# EasyEDA Pro project SD-Swicharoo.eprj, board SD_Swicharoo
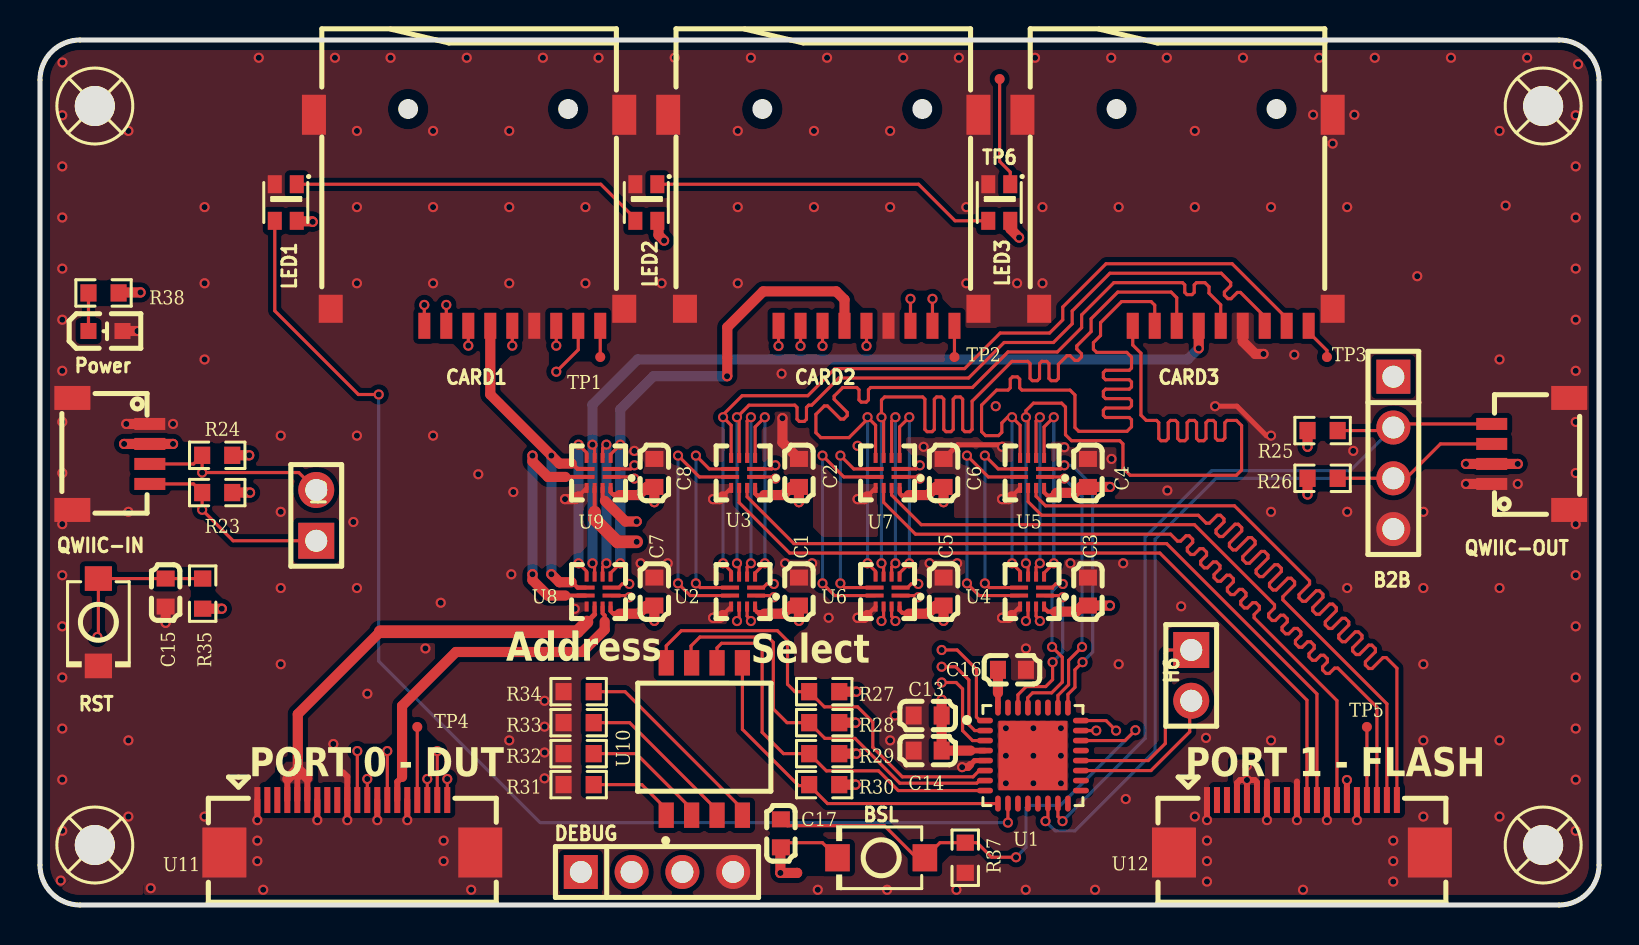
[diagram p2: board, top side]
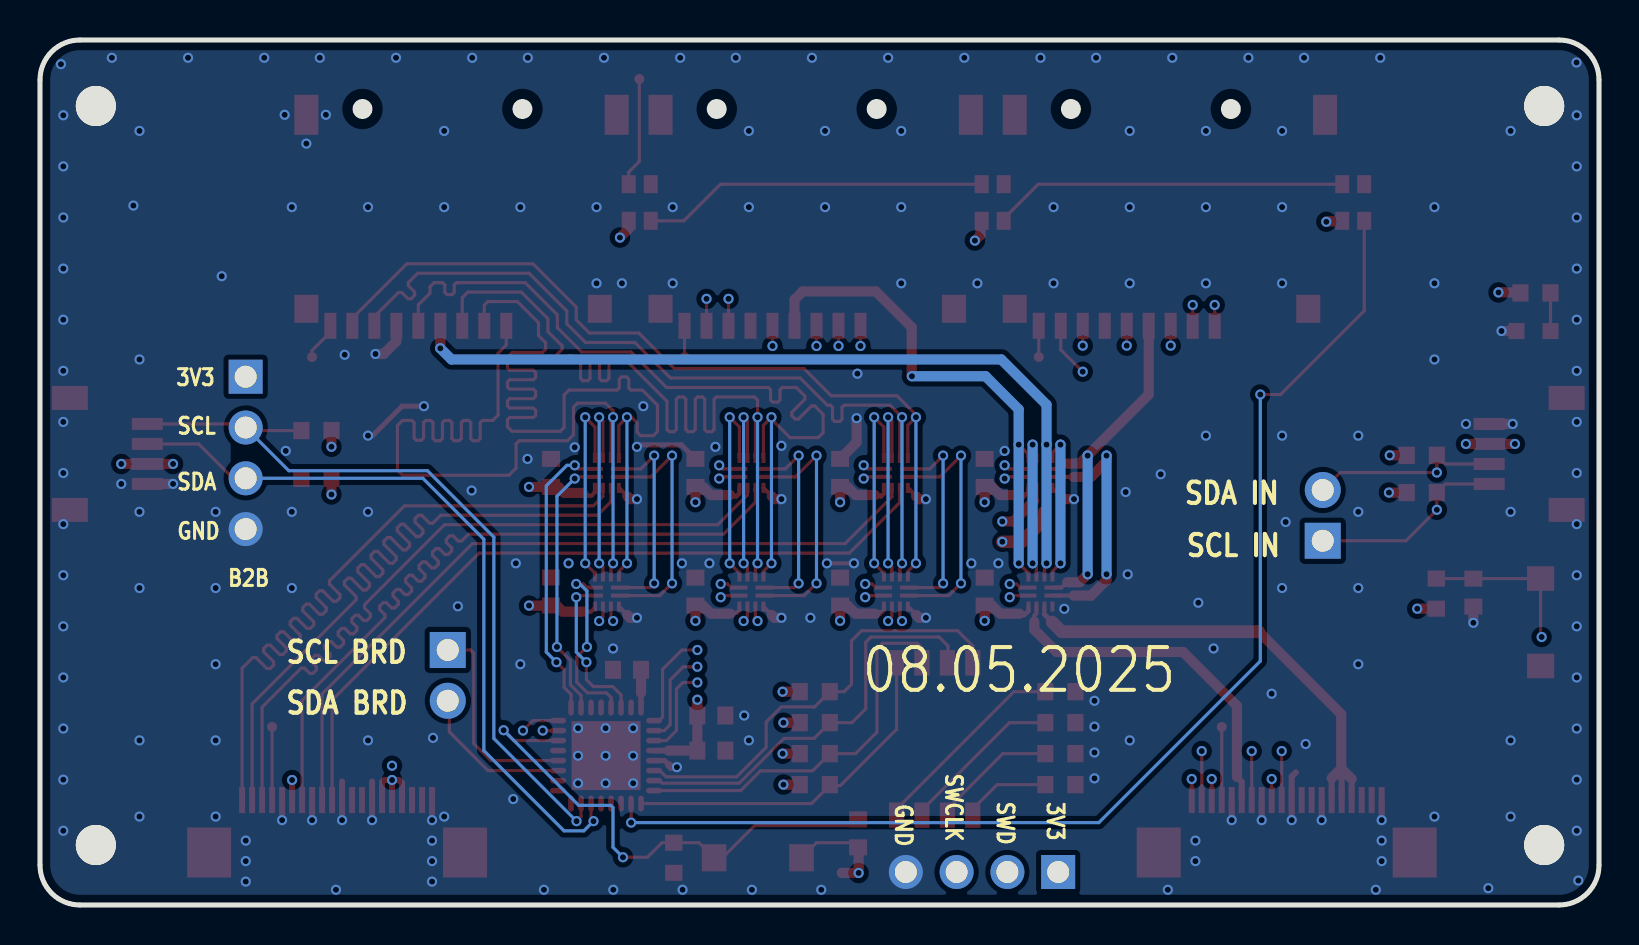
[diagram p3: board, bottom side, seen from below]

Outline 77.98 x 43.26 mm; copper layers: Top Layer, GND02, SIG03, GND04, PWR05, Bottom Layer. Coordinates in mm from the lower left corner of the outline.
Outline path: 0,41.26 0,2 arc(0.59,0.59) 2,0 75.98,0 arc(77.39,0.59) 77.98,2 77.98,41.26 arc(77.39,42.67) 75.98,43.26 2,43.26 arc(0.59,42.67) 0,41.26
Stack: Top Layer 0.035mm 外层铜厚1oz / Dielectric1 0.0994mm 3313 RC57% 4.2mil / GND02 0.0152mm 内层铜厚 / Dielectric2 0.55mm 0.55mm H/H No copper / SIG03 0.0152mm 内层铜厚 / Dielectric3 0.1088mm 2116 RC54% 4.9mil / GND04 0.0152mm 内层铜厚 / Dielectric4 0.55mm 0.55mm H/H No copper / PWR05 0.0152mm 内层铜厚 / Dielectric5 0.0994mm 3313 RC57% 4.2mil / Bottom Layer 0.035mm 外层铜厚1oz

## Design rules (mm)
net GND: PWR
net SD0_DAT2: SD0
net SD0_DAT3: SD0
net SD0_CMD: SD0
net SD0_VDD: PWR
net SD0_CLK: SD0
net SD0_DAT0: SD0
net SD0_DAT1: SD0
net SD0_CD: SD0
net SD1_DAT2: SD1
net SD1_DAT3: SD1
net SD1_CMD: SD1
net SD1_VDD: PWR
net SD1_CLK: SD1
net SD1_DAT0: SD1
net SD1_DAT1: SD1
net SD1_CD: SD1
net SD2_DAT2: SD2
net SD2_DAT3: SD2
net SD2_CMD: SD2
net SD2_VDD: PWR
net SD2_CLK: SD2
net SD2_DAT0: SD2
net SD2_DAT1: SD2
net SD2_CD: SD2
net SDIN_DET: SDIN
net SDIN_DAT2: SDIN
net SDIN_DAT3: SDIN
net SDIN_CMD: SDIN
net SDIN_CLK: SDIN
net SDIN_DAT0: SDIN
net SDIN_DAT1: SDIN
net SDIN_1V8: PWR
net SDOUT_DET: SDOUT
net SDOUT_DAT2: SDOUT
net SDOUT_DAT3: SDOUT
net SDOUT_CMD: SDOUT
net SDOUT_CLK: SDOUT
net SDOUT_DAT0: SDOUT
net SDOUT_DAT1: SDOUT
net SDOUT_1V8: PWR
net SD0_1V8: PWR
net SD2_1V8: PWR
net SD1_1V8: PWR
net 3V3: PWR
template: 自定义配置
spacing copperThickness1oz (default): track to track 0.157, other pairs 0.152 to 0.508
spacing 3W: track to track 0.315, other pairs 0.152 to 0.3
spacing safeClearance1: track to track 0.284, other pairs 0.152 to 0.3
track width copperThickness1oz (default): min 0.127, default 0.157, max 2.54
track width PWR: min 0.127, default 0.508, max 2.54
track width 50OHM L1/L6: min 0.127, default 0.157, max 2.54
track width 50OHM-L3: min 0.127, default 0.142, max 2.54
differential pair differentialPair (default): width min 0.127, default 0.254, max 2.54; gap min 0.152, default 0.152
via viaSize (default): diameter min 0.5, default 0.508, max 10; hole min 0.3, default 0.305, max 6.299
net class PWR uses PWR
net class SD0 uses 50OHM-L3, safeClearance1
net class SD1 uses 50OHM-L3, safeClearance1
net class SD2 uses 3W, 50OHM L1/L6
net class SDIN uses 50OHM-L3, safeClearance1
net class SDOUT uses 3W, 50OHM L1/L6
net GND uses PWR
net SD0_DAT2 uses 50OHM-L3, safeClearance1
net SD0_DAT3 uses 50OHM-L3, safeClearance1
net SD0_CMD uses 50OHM-L3, safeClearance1
net SD0_VDD uses PWR
net SD0_CLK uses 50OHM-L3, safeClearance1
net SD0_DAT0 uses 50OHM-L3, safeClearance1
net SD0_DAT1 uses 50OHM-L3, safeClearance1
net SD0_CD uses 50OHM-L3, safeClearance1
net SD1_DAT2 uses 50OHM-L3, safeClearance1
net SD1_DAT3 uses 50OHM-L3, safeClearance1
net SD1_CMD uses 50OHM-L3, safeClearance1
net SD1_VDD uses PWR
net SD1_CLK uses 50OHM-L3, safeClearance1
net SD1_DAT0 uses 50OHM-L3, safeClearance1
net SD1_DAT1 uses 50OHM-L3, safeClearance1
net SD1_CD uses 50OHM-L3, safeClearance1
net SD2_DAT2 uses 3W, 50OHM L1/L6
net SD2_DAT3 uses 3W, 50OHM L1/L6
net SD2_CMD uses 3W, 50OHM L1/L6
net SD2_VDD uses PWR
net SD2_CLK uses 3W, 50OHM L1/L6
net SD2_DAT0 uses 3W, 50OHM L1/L6
net SD2_DAT1 uses 3W, 50OHM L1/L6
net SD2_CD uses 3W, 50OHM L1/L6
net SDIN_DET uses 50OHM-L3, safeClearance1
net SDIN_DAT2 uses 50OHM-L3, safeClearance1
net SDIN_DAT3 uses 50OHM-L3, safeClearance1
net SDIN_CMD uses 50OHM-L3, safeClearance1
net SDIN_CLK uses 50OHM-L3, safeClearance1
net SDIN_DAT0 uses 50OHM-L3, safeClearance1
net SDIN_DAT1 uses 50OHM-L3, safeClearance1
net SDIN_1V8 uses PWR
net SDOUT_DET uses 3W, 50OHM L1/L6
net SDOUT_DAT2 uses 3W, 50OHM L1/L6
net SDOUT_DAT3 uses 3W, 50OHM L1/L6
net SDOUT_CMD uses 3W, 50OHM L1/L6
net SDOUT_CLK uses 3W, 50OHM L1/L6
net SDOUT_DAT0 uses 3W, 50OHM L1/L6
net SDOUT_DAT1 uses 3W, 50OHM L1/L6
net SDOUT_1V8 uses PWR
net SD0_1V8 uses PWR
net SD2_1V8 uses PWR
net SD1_1V8 uses PWR
net 3V3 uses PWR
region e236 uses copperThickness1oz
region e237 uses copperThickness1oz
region e238 uses copperThickness1oz
region e240 uses copperThickness1oz
region e1231 uses copperThickness1oz
region e1232 uses copperThickness1oz
region e3776 uses copperThickness1oz
region e4768 uses copperThickness1oz
pour e4718 uses PWR
region e386 uses copperThickness1oz

## Placement (name value [footprint] x y rotation side)
B2B  PZ254V-11-04P  [HDR-TH_4P-P2.54-V-M]  67.69 22.61 270 top
BSL  TS-1088-AR02016  [SW-SMD_L3.9-W3.0-P4.45]  42.07 2.36 180 top
C1  0.1uF  [C0603]  37.96 15.67 270 top
C2  0.1uF  [C0603]  37.96 21.61 270 top
C3  0.1uF  [C0603]  52.42 15.67 270 top
C4  0.1uF  [C0603]  52.42 21.61 270 top
C5  0.1uF  [C0603]  45.19 15.67 270 top
C6  0.1uF  [C0603]  45.19 21.61 270 top
C7  0.1uF  [C0603]  30.73 15.67 270 top
C8  0.1uF  [C0603]  30.73 21.61 270 top
C13  10uF  [C0603]  44.4 9.48 180 top
C14  100nF  [C0603]  44.4 7.72 180 top
C15  10nF  [C0603]  6.28 15.63 270 top
C16  0.47uF  [C0603]  48.61 11.76 0 top
C17  10nF  [C0603]  37.06 3.58 270 top
CARD1  TF-01A  [TF-SMD_TF-01A]  21.46 34.24 180 top
CARD2  TF-01A  [TF-SMD_TF-01A]  39.18 34.24 180 top
CARD3  TF-01A  [TF-SMD_TF-01A]  56.9 34.24 180 top
DEBUG  PZ254V-11-04P  [HDR-TH_4P-P2.54-V-M]  30.86 1.65 0 top
H5  -  [HDR-TH_2P-P2.54-V-M-1]  13.82 19.48 90 top
H6  -  [HDR-TH_2P-P2.54-V-M-1]  57.58 11.48 270 top
LED1  WS2812B-2020  [LED-SMD_4P-L2.0-W2.0-TL_WS2812B-2020]  12.29 35.13 270 top
LED2  WS2812B-2020  [LED-SMD_4P-L2.0-W2.0-TL_WS2812B-2020]  30.33 35.13 270 top
LED3  WS2812B-2020  [LED-SMD_4P-L2.0-W2.0-TL_WS2812B-2020]  47.98 35.13 270 top
Power  SZYY0603YG  [LED0603-R-RD_GREEN]  3.28 28.7 0 top
QWIIC-IN  SM04B-SRSS-TB(LF)(SN)  [CONN-SMD_4P-P1.00_SM04B-SRSS-TB-LF-SN]  3.56 22.56 270 top
QWIIC-OUT  SM04B-SRSS-TB(LF)(SN)  [CONN-SMD_4P-P1.00_SM04B-SRSS-TB-LF-SN]  74.55 22.56 90 top
R23  4.7K  [R0603]  8.86 20.63 0 top
R24  4.7K  [R0603]  8.86 22.49 0 top
R25  4.7K  [R0603]  64.15 23.73 180 top
R26  4.7K  [R0603]  64.15 21.34 180 top
R27  1K  [R0603]  39.22 10.67 0 top
R28  1K  [R0603]  39.22 9.12 0 top
R29  1K  [R0603]  39.22 7.57 0 top
R30  1K  [R0603]  39.22 6.02 0 top
R31  100K  [R0603]  26.94 6.02 0 top
R32  1K  [R0603]  26.94 7.57 0 top
R33  1K  [R0603]  26.94 9.12 0 top
R34  1K  [R0603]  26.94 10.67 0 top
R35  47K  [R0603]  8.14 15.57 270 top
R37  47K  [R0603]  46.28 2.36 90 top
R38  1K  [R0603]  3.18 30.61 0 top
RST  TS-1088-AR02016  [SW-SMD_L3.9-W3.0-P4.45]  2.92 14.14 270 top
SCREW1  -  [Screw-Hole-M2]  2.74 39.96 0 top
SCREW2  -  [Screw-Hole-M2]  75.18 39.96 0 top
SCREW3  -  [Screw-Hole-M2]  2.74 3 0 top
SCREW4  -  [Screw-Hole-M2]  75.18 3 0 top
TP1  -  [Test-Point-0.5mm]  28.02 27.41 0 top
TP2  -  [Test-Point-0.5mm]  45.74 27.41 0 top
TP3  -  [Test-Point-0.5mm]  64.37 27.41 0 top
TP4  -  [Test-Point-0.5mm]  18.87 8.9 0 top
TP5  -  [Test-Point-0.5mm]  66.37 8.9 0 top
TP6  -  [Test-Point-0.5mm]  48 41.31 0 top
U1  MSPM0L1227SRHBR  [VQFN-32_L5.0-W5.0-P0.50-TL-EP3.5]  49.66 7.47 0 top
U2  TMUX131RMGR  [QFN-12L_L1.8-W1.8-P0.40-TL_TS3USB3031RMGR]  35.17 15.67 180 top
U3  TMUX131RMGR  [QFN-12L_L1.8-W1.8-P0.40-TL_TS3USB3031RMGR]  35.17 21.61 180 top
U4  TMUX131RMGR  [QFN-12L_L1.8-W1.8-P0.40-TL_TS3USB3031RMGR]  49.62 15.67 180 top
U5  TMUX131RMGR  [QFN-12L_L1.8-W1.8-P0.40-TL_TS3USB3031RMGR]  49.62 21.61 180 top
U6  TMUX131RMGR  [QFN-12L_L1.8-W1.8-P0.40-TL_TS3USB3031RMGR]  42.39 15.67 180 top
U7  TMUX131RMGR  [QFN-12L_L1.8-W1.8-P0.40-TL_TS3USB3031RMGR]  42.4 21.61 180 top
U8  TMUX131RMGR  [QFN-12L_L1.8-W1.8-P0.40-TL_TS3USB3031RMGR]  27.94 15.67 180 top
U9  TMUX131RMGR  [QFN-12L_L1.8-W1.8-P0.40-TL_TS3USB3031RMGR]  27.94 21.61 180 top
U10  HX 1.27-4P TPPT  [SW-SMD_8P-P1.27-L6.7-W5.4]  33.23 8.3 0 top
U11  05A20L20P  [FPC-SMD_20P-P0.50_L5.9-W14.4]  15.62 3.94 0 top
U12  05A20L20P  [FPC-SMD_20P-P0.50_L5.9-W14.4]  63.12 3.94 0 top

## Footprints (pads in the part's own frame, mm; a bottom-side part is the same pattern mirrored in y, then rotated)
C0603
  rect 0.8x0.9 smd: 1(-0.7,0) 2(0.7,0)
CONN-SMD_4P-P1.00_SM04B-SRSS-TB-LF-SN
  rect 0.6x1.55 smd: 1(-1.5,1.938) 2(-0.5,1.938) 3(0.5,1.938) 4(1.5,1.938)
  rect 1.2x1.8 smd: 5(2.8,-1.938) 6(-2.8,-1.938)
FPC-SMD_20P-P0.50_L5.9-W14.4
  rect 0.3x1.3 smd: 1(-4.75,1.312) 2(-4.25,1.312) 3(-3.75,1.312) 4(-3.25,1.312) 5(-2.75,1.312) 6(-2.25,1.312) 7(-1.75,1.312) 8(-1.25,1.312) 9(-0.75,1.312) 10(-0.25,1.312) 11(0.25,1.312) 12(0.75,1.312) 13(1.25,1.312) 14(1.75,1.312) 15(2.25,1.312) 16(2.75,1.312) 17(3.25,1.312) 18(3.75,1.312) 19(4.25,1.312) 20(4.75,1.312)
  rect 2.2x2.5 smd: 21(-6.4,-1.312) 22(6.4,-1.312)
HDR-TH_2P-P2.54-V-M-1
  rect 1.8x1.8 hole 1.1: 1(-1.27,0)
  round 1.8 hole 1.1: 2(1.27,0)
HDR-TH_4P-P2.54-V-M
  rect 1.7x1.7 hole 1.1: 1(-3.81,0)
  round 1.7 hole 1.1: 2(-1.27,0) 3(1.27,0) 4(3.81,0)
LED0603-R-RD_GREEN
  rect 0.8x0.8 smd: 1(0.851,0) 2(-0.851,0)
LED-SMD_4P-L2.0-W2.0-TL_WS2812B-2020
  rect 0.9x0.7 smd: 1(-0.915,0.55) 2(-0.915,-0.55) 3(0.915,-0.55) 4(0.915,0.55)
QFN-12L_L1.8-W1.8-P0.40-TL_TS3USB3031RMGR
  rect 0.9x0.2 smd: 1(-0.65,0.2) 2(-0.65,-0.2) 7(0.65,-0.2) 8(0.65,0.2)
  rect 0.2x0.5 smd: 3(-0.6,-0.75) 4(-0.2,-0.75) 5(0.2,-0.75) 6(0.6,-0.75) 9(0.6,0.75) 10(0.2,0.75) 11(-0.2,0.75) 12(-0.6,0.75)
R0603
  rect 0.806x0.864 smd: 1(-0.753,0) 2(0.753,0)
Screw-Hole-M2
  round 2 hole 2: 1(0,0)
SW-SMD_8P-P1.27-L6.7-W5.4
  rect 0.76x1.27 smd: 1(-1.905,-3.81) 2(-0.635,-3.81) 3(0.635,-3.81) 4(1.905,-3.81) 5(1.905,3.81) 6(0.635,3.81) 7(-0.635,3.81) 8(-1.905,3.81)
SW-SMD_L3.9-W3.0-P4.45
  rect 1.23x1.36 smd: 1(-2.185,0) 2(2.185,0)
Test-Point-0.5mm
  round 0.5 smd: 1(0,0)
TF-SMD_TF-01A
  rect 0.6x1.3 smd: 1(2.24,5.276) 2(1.14,5.276) 3(0.04,5.276) 4(-1.06,5.276) 5(-2.16,5.276) 6(-3.26,5.276) 7(-4.36,5.276) 8(-5.46,5.276) 9(-6.56,5.276)
  rect 1.2x1.4 smd: 10(-7.76,4.426) 13(6.92,4.426)
  rect 1.2x2 smd: 11(-7.76,-5.276) 12(7.76,-5.276)
VQFN-32_L5.0-W5.0-P0.50-TL-EP3.5
  oval 0.8x0.28 smd: 1(-2.4,1.75) 2(-2.4,1.25) 3(-2.4,0.75) 4(-2.4,0.25) 5(-2.4,-0.25) 6(-2.4,-0.75) 7(-2.4,-1.25) 8(-2.4,-1.75) 17(2.4,-1.75) 18(2.4,-1.25) 19(2.4,-0.75) 20(2.4,-0.25) 21(2.4,0.25) 22(2.4,0.75) 23(2.4,1.25) 24(2.4,1.75)
  oval 0.28x0.8 smd: 9(-1.75,-2.4) 10(-1.25,-2.4) 11(-0.75,-2.4) 12(-0.25,-2.4) 13(0.25,-2.4) 14(0.75,-2.4) 15(1.25,-2.4) 16(1.75,-2.4) 25(1.75,2.4) 26(1.25,2.4) 27(0.75,2.4) 28(0.25,2.4) 29(-0.25,2.4) 30(-0.75,2.4) 31(-1.25,2.4) 32(-1.75,2.4)
  rect 3.45x3.45 smd: 33(-0.001,0)

## Nets
As in the schematic, except:
GND: B2B.4 C1.1 C2.1 C3.1 C4.1 C5.1 C6.1 C7.1 C8.1 C13.2 C14.2 C15.2 C16.2 CARD1.6 CARD1.10 CARD1.11 CARD1.12 CARD1.13 CARD2.6 CARD2.10 CARD2.11 CARD2.12 CARD2.13 CARD3.6 CARD3.10 CARD3.11 CARD3.12 CARD3.13 DEBUG.4 LED1.2 LED2.2 LED3.2 Power.1 QWIIC-IN.1 QWIIC-IN.5 QWIIC-IN.6 QWIIC-OUT.1 QWIIC-OUT.5 QWIIC-OUT.6 R31.1 R32.1 R33.1 R34.1 R37.1 RST.2 SCREW1.1 SCREW2.1 SCREW3.1 SCREW4.1 U1.5 U1.33 U2.9 U3.9 U4.9 U5.9 U6.9 U7.9 U8.9 U9.9 U11.1 U11.7 U11.10 U11.13 U11.16 U11.21 U11.22 U12.1 U12.7 U12.10 U12.13 U12.16 U12.21 U12.22
$1N18208: Power.2 R38.1

Pads without a net: U1 11 12 13 16 17 18 21 27 28 31

## Via types
v1: diameter 0.508, hole 0.305, Top Layer to Bottom Layer, 354 vias

## Routing (per net, layer and track width the routed paths; a pad name or vN(x,y) marks a point on that pad's centre or on a via; arc(x,y) is an arc through that point)
3V3: length 55.7
  Top Layer w0.158: BSL.2 39.14,3.12 37.29,3.12 C17.2
  Top Layer w0.201: 36.22,20.5 36.14,20.42 35.92,20.42 35.85,20.49 ; 28.91,14.49 28.74,14.49 28.64,14.6 ; 50.56,20.48 50.39,20.48 50.22,20.64 U5.12 ; 50.56,20.48 50.7,20.48 50.83,20.61 ; 50.56,20.48 50.7,20.61 50.7,20.65 ; 28.64,20.55 28.77,20.42 28.91,20.42 ; 28.64,20.55 28.85,20.55 ; 28.64,20.55 28.54,20.65 28.54,20.86 ; 50.56,14.67 50.81,14.67 ; 50.56,14.67 50.67,14.56 ; 50.56,14.67 50.41,14.67 50.22,14.86 U4.12 ; 28.64,14.6 28.54,14.7 28.54,14.92 ; 28.64,14.6 28.79,14.6 28.8,14.61 ; 35.87,14.65 36.12,14.65 ; 35.87,14.65 35.97,14.56 ; 35.87,14.65 35.77,14.76 U2.12 ; 43.09,20.49 43.13,20.48 43.23,20.48 ; 43.09,20.49 43.15,20.42 43.38,20.42 ; 43.09,20.49 43,20.57 43,20.86 ; 43.21,14.61 43.13,14.61 42.99,14.74 U6.12 ; 43.21,14.61 43.26,14.61 ; 43.21,14.61 43.33,14.48 ; 36,20.48 35.9,20.48 35.85,20.49 ; 35.85,20.49 35.77,20.57 U3.12 ; 35.97,14.56 36.09,14.43 ; 35.97,14.56 36.21,14.56
  Top Layer w0.28: U1.4 46.54,7.72
  Top Layer w0.508: R25.2 v1(63.4,22.92) ; v1(13.64,34.17) 13.61,34.19 12.88,34.19 ; v1(73.91,22.06) QWIIC-OUT.2 v1(71.32,22.06) ; C17.2 37.03,2.86 v1(37.03,1.6) 37.87,1.6 37.87,1.61 ; 43.45,20.5 44.41,20.5 44.82,20.91 C6.2 v1(45.19,20.15) ; v1(31.22,33.23) 30.94,33.51 30.94,34.22 ; 28.99,14.57 29.95,14.57 30.35,14.97 C7.2 v1(30.73,14.21) ; 43.45,14.57 44.41,14.57 44.82,14.97 C5.2 v1(45.19,14.21) ; v1(63.4,20.53) R26.2 ; 50.83,20.61 51.75,20.61 52.05,20.91 C4.2 v1(53.52,20.91) ; v1(37.96,14.21) C1.2 37.59,14.97 37.18,14.57 36.22,14.57 ; v1(53.52,14.97) C3.2 52.14,14.97 51.84,14.67 50.81,14.67 ; R35.2 v1(9.09,14.82) ; 36.22,20.5 37.18,20.5 37.59,20.91 C2.2 v1(37.96,20.15) ; R28.2 v1(40.79,9.12) ; R24.2 v1(10.47,22.49) ; 28.99,20.5 29.95,20.5 30.35,20.91 C8.2 v1(30.73,20.15) ; R30.2 v1(40.79,6.02) ; 48.54,34.12 48.54,33.81 v1(48.97,33.38) ; v1(4.21,23.06) QWIIC-IN.2 v1(6.66,23.06) ; v1(45.1,10.26) C13.1 C14.1 46.54,7.72 ; 9.66,20.63 v1(10.51,20.63) ; 40.02,10.67 v1(40.83,10.67) ; 40.02,7.57 v1(40.83,7.57) ; 3.91,30.64 v1(5.03,30.64)
GND: length 39.3
  Top Layer w0.201: U4.9 48.6,14.51 ; U7.9 41.38,20.44 ; U9.9 26.92,20.44 ; 41.79,14.92 41.38,14.51 ; 34.57,20.86 34.15,20.44 ; U2.9 34.15,14.51 ; U5.9 48.6,20.44
  Top Layer w0.203: v1(37.27,17.09) v1(38.62,17.09)
  Top Layer w0.254: v1(58.78,24.95) 59.87,24.95 61.34,23.47 v1(61.57,23.47) ; C6.1 45.9,23.02 48.02,23.02 v1(48.12,22.91) ; 46.53,7.01 46.74,7.22 U1.5
  Top Layer w0.299: v1(15.37,4.24) U11.10 15.37,6.43 15.16,6.63 ; 18.37,5.25 v1(18.37,4.24) ; U12.13 v1(64.37,4.24) ; 62.87,6.18 U12.10 v1(62.87,4.24) ; U11.13 v1(16.87,4.24) ; 61.37,6.18 U12.7 v1(61.37,4.24) ; U11.1 v1(10.87,4.24) ; U12.1 v1(58.37,4.24) ; U11.7 v1(13.87,4.24) ; U12.16 v1(65.87,4.24)
  Top Layer w0.381: v1(46.12,6.89) 46.41,6.89 46.53,7.01
  Top Layer w0.508: v1(61.2,27.56) 60.79,27.56 60.16,28.19 CARD3.6 ; 34.15,20.44 34.01,20.3 v1(33.67,20.3) ; 48.6,20.44 48.46,20.3 v1(48.12,20.3) ; v1(26.26,20.3) 26.78,20.3 26.92,20.44 ; v1(40.89,14.36) 41.23,14.36 41.38,14.51 ; 48.6,14.51 48.46,14.36 v1(48.12,14.36) ; C2.1 37.13,23.13 v1(37.13,24.35) ; v1(33.67,14.36) 34.01,14.36 34.15,14.51 ; v1(6.28,14.11) C15.2 ; QWIIC-OUT.1 v1(71.32,21.06) ; v1(40.89,20.3) 41.23,20.3 41.38,20.44 ; QWIIC-IN.1 v1(4.32,24.06) ; Power.1 v1(4.88,28.7)
  vias: v1(1.04,1.22) v1(1.12,42.13) v1(1.11,39.49) v1(1.11,36.94) v1(1.11,34.38) v1(1.11,31.83) v1(1.11,29.27) v1(1.11,26.72) v1(1.11,24.16) v1(1.11,21.6) v1(1.11,19.05) v1(1.11,16.49) v1(1.11,13.94) v1(1.11,11.38) v1(1.11,8.82) v1(1.11,6.27) v1(1.11,3.71) v1(4.42,38.71) v1(4.42,19.66) v1(4.42,8.23) v1(4.42,4.42) v1(5.54,0.84) v1(6.66,24.06) v1(8.23,34.9) v1(8.23,31.09) v1(8.23,27.28) v1(8.23,4.42) v1(10.94,42.37) v1(10.87,3.22) v1(10.87,2.2) v1(11.16,0.76) v1(12.04,23.47) v1(12.04,19.66) v1(12.04,15.85) v1(12.04,12.04) v1(14.67,8.05) v1(14.75,42.37) v1(15.67,19.15) v1(15.85,38.71) v1(15.85,34.9) v1(15.85,31.09) v1(15.85,23.47) v1(15.85,15.85) v1(16.37,10.57) v1(17.53,42.37) v1(19.28,12.83) v1(19.66,38.71) v1(19.66,34.9) v1(19.66,31.09) v1(19.66,23.47) v1(20.04,15.12) v1(20.19,3.22) v1(20.19,2.2) v1(21.34,42.37) v1(21.57,0.76) v1(21.92,21.54) v1(23.47,38.71) v1(23.47,34.9) v1(23.47,31.09) v1(23.47,8.23) v1(23.57,16.54) v1(23.68,20.65) v1(25.16,42.37) v1(25.24,10.21) v1(25.24,8.92) v1(25.24,7.63) v1(25.24,6.33) v1(26.75,14.81) v1(27.28,34.9) v1(27.28,31.09) v1(27.94,42.37) v1(29.73,22.71) v1(30.04,17.09) v1(31.09,31.09) v1(31.39,17.09) v1(31.75,42.37) v1(34.9,38.71) v1(34.9,34.9) v1(34.9,31.09) v1(35.56,42.37) v1(37.09,26.57) v1(38.71,38.71) v1(38.71,34.9) v1(38.9,0.76) v1(39.37,42.37) v1(39.45,14.36) v1(40.89,22.96) v1(42.37,0.76) v1(42.52,38.71) v1(42.52,34.9) v1(42.52,8.23) v1(42.76,9.48) v1(43.18,42.37) v1(44.2,22.91) v1(44.49,17.09) v1(45.84,0.76) v1(45.87,17.09) v1(45.96,42.37) v1(46.33,34.9) v1(46.33,31.09) v1(47.8,24.95) v1(48.31,8.84) v1(48.31,7.47) v1(48.31,6.09) v1(48.87,31.09) v1(49.31,12.83) v1(49.3,0.76) v1(49.69,8.84) v1(49.69,7.47) v1(49.69,6.09) v1(49.77,42.37) v1(50.14,34.9) v1(50.14,31.09) v1(51.06,8.84) v1(51.06,7.47) v1(51.06,6.09) v1(51.23,22.89) v1(51.54,17.09) v1(52.77,0.76) v1(53.58,42.37) v1(53.59,22.31) v1(53.95,34.9) v1(53.95,12.04) v1(54.18,17.09) v1(54.31,5.3) v1(56.36,42.37) v1(56.39,20.73) v1(57.08,14.94) v1(57.76,38.71) v1(57.76,34.9) v1(57.76,4.42) v1(58.32,8.36) v1(58.37,3.22) v1(58.37,2.2) v1(58.37,1.17) v1(60.17,42.37) v1(61.57,34.9) v1(61.57,19.66) v1(61.57,8.23) v1(62.74,27.52) v1(63.17,0.76) v1(63.68,39.52) v1(63.98,42.37) v1(64.66,38.08) v1(65.38,34.9) v1(65.38,19.66) v1(65.38,15.85) v1(65.74,39.52) v1(65.68,22.71) v1(66.76,42.37) v1(67.69,3.22) v1(67.69,2.2) v1(67.69,1.17) v1(68.89,31.45) v1(69.19,19.66) v1(69.19,15.85) v1(69.19,12.04) v1(69.19,8.23) v1(69.19,4.42) v1(70.57,42.37) v1(73,38.71) v1(73,27.28) v1(73,19.66) v1(73,15.85) v1(73,8.23) v1(73,4.42) v1(73.31,34.98) v1(73.91,21.06) v1(74.38,42.37) v1(76.81,39.49) v1(76.81,36.94) v1(76.81,34.38) v1(76.81,31.83) v1(76.81,29.27) v1(76.81,26.72) v1(76.81,24.16) v1(76.81,21.6) v1(76.81,19.05) v1(76.81,16.49) v1(76.81,13.94) v1(76.81,11.38) v1(76.81,8.82) v1(76.81,6.27) v1(76.81,3.71) v1(76.93,42.05)
I2C_BRD_SCL: length 10.5
  Top Layer w0.158: H6.1 56.44,12.75 56.29,12.6 56.29,8.08 55.43,7.22 U1.20
I2C_BRD_SDA: length 7.8
  Top Layer w0.158: H6.2 57.51,10.14 57.51,8.66 55.57,6.72 U1.19
I2C_IN_SCL: length 68
  Top Layer w0.158: QWIIC-IN.4 7.68,21.06 R23.1 v1(8.11,19.76) 9.66,18.21 H5.1 ; U1.2 46.75,8.72 46.46,9.02 46.46,11.26 45.8,11.92 v1(45.1,11.92)
  SIG03 w0.158: v1(8.11,19.76) 8.11,12.29 15.21,5.18 38.35,5.18 39.06,5.9 39.06,10.98 39.62,11.53 44.72,11.53 v1(45.1,11.92)
I2C_IN_SDA: length 69.3
  Top Layer w0.158: H5.2 12.94,21.63 v1(8.11,21.63) R24.1 7.68,22.06 QWIIC-IN.3 ; U1.1 47.02,9.22 46.84,9.4 46.84,11.79 45.87,12.75 v1(45.1,12.75)
  SIG03 w0.158: v1(8.11,21.63) 8.6,21.14 8.6,12.59 15.55,5.64 38.2,5.64 38.66,6.1 38.66,11.13 39.38,11.85 44.19,11.85 v1(45.1,12.75)
I2C_OUT_SCL: length 39.4
  Top Layer w0.158: v1(51.14,4.19) 50.91,4.42 U1.15 ; QWIIC-OUT.4 67.87,24.06 B2B.2 67.54,23.73 R25.1
  Bottom Layer w0.158: B2B.2 65.53,21.72 58.6,21.72 55.28,18.4 55.28,8.33 v1(51.14,4.19)
I2C_OUT_SDA: length 40.4
  Top Layer w0.158: R26.1 B2B.3 68.33,21.34 70.05,23.06 QWIIC-OUT.3 ; U1.14 50.41,4.32 v1(50.29,4.19)
  Bottom Layer w0.158: v1(50.29,4.19) 50.78,3.71 51.76,3.71 55.78,7.72 55.78,18.29 58.83,21.34 B2B.3
NRST: length 64.2
  Top Layer w0.158: U1.3 46.64,8.22 46.14,8.72 46.14,10.81 45.82,11.13 v1(45.1,11.13) ; v1(2.87,13.4) 2.92,13.45 RST.1 C15.1 R35.1
  SIG03 w0.158: v1(45.1,11.13) 45.02,11.2 40,11.2 39.47,10.67 39.47,5.64 38.56,4.73 14.78,4.73 6.11,13.4 v1(2.87,13.4)
PA2: length 22.3
  Top Layer w0.158: U1.6 46.98,6.72 46.66,6.41 43.13,6.41 41.66,7.89 41.66,9.15 40.89,9.91 39.23,9.91 R27.1 37.76,10.67 37.39,11.04 37.39,13.21 36.88,13.72 32.08,13.72 31.32,12.96 U10.8
PA3: length 20.8
  Top Layer w0.158: U1.7 46.99,6.22 46.86,6.09 43,6.09 40.76,8.33 39.26,8.33 R28.1 37.37,9.12 36.68,9.81 36.68,13.13 36.41,13.4 33.01,13.4 32.56,12.96 32.56,12.14 U10.7
PA4: length 19.7
  Top Layer w0.158: U1.8 42.93,5.72 41.94,6.71 39.33,6.71 R29.1 37.19,7.57 36.12,8.64 36.12,12.82 35.85,13.09 34.09,13.09 33.86,12.86 U10.6
PA5: length 17.7
  Top Layer w0.158: U1.9 39.39,5.07 38.47,5.99 R30.1 38.42,5.97 37.95,5.97 35.13,8.79 U10.5
PA18/BSL: length 25.9
  Top Layer w0.158: v1(54.79,8.74) 54.27,8.22 U1.22 ; C17.1 37.38,3.97 42.24,3.97 43.84,2.36 BSL.1 45.01,3.12 R37.2 46.87,3.12 47.6,2.39 v1(48.82,2.39)
  Bottom Layer w0.158: v1(54.79,8.74) 51.03,4.98 49.43,4.98 49.32,4.87 49.32,2.89 v1(48.82,2.39)
SD0_1V8: length 12.5
  Top Layer w0.201: 27.29,15.48 26.28,15.48 ; U9.8 26.28,21.41
  Top Layer w0.508: 26.28,21.41 25.41,21.41 24.63,22.18 v1(24.63,22.48) ; v1(24.63,16.54) 24.63,16.25 25.41,15.48 26.28,15.48
  Bottom Layer w0.508: v1(24.63,16.54) v1(24.63,22.48)
SD0_CD: length 1.6
  Top Layer w0.158: TP1.1 CARD1.9
SD0_CLK: length 42.7
  Top Layer w0.158: 41.75,15.48 39.75,15.48 v1(39.14,16.08) ; U7.8 40.21,21.41 v1(39.14,22.48) ; CARD1.5 v1(23.62,27.97)
  SIG03 w0.142: v1(23.62,27.97) 23.62,25.96 23.39,25.73 22.08,25.73 21.91,25.89 21.91,26.36 22.02,26.46 22.25,26.46 22.35,26.56 22.35,26.79 22.25,26.89 22.02,26.89 21.91,26.99 21.91,27.22 22.02,27.32 22.25,27.32 22.35,27.42 22.35,27.64 22.25,27.74 22.02,27.74 21.91,27.84 21.91,28.07 22.02,28.17 22.25,28.17 22.35,28.27 22.35,28.5 22.25,28.6 22.02,28.6 21.91,28.7 21.91,28.83 22.19,29.11 22.87,29.11 22.97,29.01 22.97,28.81 23.07,28.7 23.3,28.7 23.4,28.81 23.4,29.01 23.5,29.11 26.85,29.11 33.48,22.48 v1(39.14,22.48)
  Bottom Layer w0.158: v1(39.14,22.48) v1(39.14,16.08)
SD0_CMD: length 42.8
  Top Layer w0.158: CARD1.3 v1(21.42,27.97) ; U7.7 40.7,21.81 v1(40.03,22.48) ; v1(40.03,16.08) 40.24,15.87 U6.7
  SIG03 w0.142: v1(21.42,27.97) 21.49,27.91 21.49,27.38 21.31,27.21 19.58,27.21 19.3,27.49 19.3,29.31 19.52,29.53 20.02,29.53 20.12,29.43 20.12,28.75 20.22,28.65 20.44,28.65 20.54,28.75 20.54,29.43 20.64,29.53 20.87,29.53 20.97,29.43 20.97,28.75 21.07,28.65 21.3,28.65 21.4,28.75 21.4,29.43 21.5,29.53 27.03,29.53 33.55,23.02 39.49,23.02 v1(40.03,22.48)
  Bottom Layer w0.158: v1(40.03,22.48) v1(40.03,16.08)
SD0_DAT0: length 42.7
  Top Layer w0.158: 34.52,15.87 33.02,15.87 v1(32.81,16.08) ; v1(32.81,22.48) 33.47,21.81 U3.7 ; CARD1.7 v1(25.82,27.97)
  SIG03 w0.142: v1(32.81,22.48) 32.81,22.55 32.08,23.27 31.94,23.27 31.57,22.9 31.42,22.9 31.26,23.06 31.26,23.2 31.64,23.58 31.64,23.72 31.48,23.88 31.34,23.88 30.67,23.21 30.52,23.21 30.36,23.37 30.36,23.51 31.03,24.18 31.03,24.32 30.87,24.48 30.73,24.48 30.06,23.81 29.92,23.81 29.76,23.97 29.76,24.11 30.43,24.78 30.43,24.92 30.27,25.08 30.13,25.08 29.46,24.41 29.32,24.41 29.16,24.57 29.16,24.72 29.83,25.39 29.83,25.53 29.67,25.69 29.52,25.69 28.85,25.02 28.71,25.02 28.55,25.18 28.55,25.32 29.22,25.99 29.22,26.13 29.06,26.29 28.92,26.29 28.25,25.62 28.11,25.62 27.95,25.78 27.95,25.92 28.62,26.59 28.62,26.73 28.46,26.89 28.32,26.89 27.65,26.23 27.51,26.23 27.35,26.38 27.35,26.53 28.02,27.2 28.02,27.34 27.86,27.5 27.71,27.5 27.04,26.83 26.9,26.83 26.74,26.99 26.74,27.13 27.41,27.8 27.41,27.94 26.68,28.68 24.31,28.68 24.13,28.5 24.13,27.96 24.23,27.86 24.44,27.86 24.54,27.76 24.54,27.54 24.44,27.44 24.23,27.44 24.13,27.33 24.13,27.13 24.38,26.88 25.35,26.88 25.82,27.35 v1(25.82,27.97)
  Bottom Layer w0.158: v1(32.81,22.48) v1(32.81,16.08)
SD0_DAT1: length 42.8
  Top Layer w0.158: U3.8 32.98,21.41 v1(31.91,22.48) ; v1(31.91,16.08) 32.52,15.48 34.52,15.48 ; v1(25.82,26.67) 26.92,27.77 CARD1.8
  SIG03 w0.142: v1(25.82,26.67) 25.49,26.34 24.22,26.34 24.08,26.19 24.08,23.77 24.23,23.62 24.59,23.62 24.7,23.73 24.7,25.54 24.8,25.64 25.02,25.64 25.12,25.54 25.12,23.73 25.22,23.62 25.45,23.62 25.55,23.73 25.55,25.54 25.65,25.64 25.88,25.64 25.98,25.54 25.98,23.73 26.08,23.62 26.3,23.62 26.4,23.73 26.4,25.54 26.5,25.64 26.73,25.64 26.83,25.54 26.83,23.73 26.93,23.62 27.16,23.62 27.26,23.73 27.26,25.45 27.36,25.55 27.58,25.55 27.68,25.45 27.68,23.73 27.78,23.62 29.5,23.62 30.65,22.48 v1(31.91,22.48)
  Bottom Layer w0.158: v1(31.91,22.48) v1(31.91,16.08)
SD0_DAT2: length 42.8
  Top Layer w0.158: 19.22,28.97 v1(19.22,30.01) ; U5.7 47.93,21.81 v1(47.26,22.48) ; v1(47.26,16.08) 47.47,15.87 U4.7
  SIG03 w0.142: v1(47.26,22.48) 45.87,23.87 34.02,23.87 27.4,30.49 19.7,30.49 v1(19.22,30.01)
  Bottom Layer w0.158: v1(47.26,22.48) v1(47.26,16.08)
SD0_DAT3: length 42.7
  Top Layer w0.158: U5.8 47.43,21.41 v1(46.37,22.48) ; 48.97,15.48 46.97,15.48 v1(46.37,16.08) ; CARD1.2 v1(20.32,30.01)
  SIG03 w0.142: v1(20.32,30.01) 20.36,29.98 27.19,29.98 33.72,23.44 45.69,23.44 46.37,22.77 v1(46.37,22.48)
  Bottom Layer w0.158: v1(46.37,22.48) v1(46.37,16.08)
SD0_VDD: length 17.4
  Top Layer w0.201: 26.7,22 26.89,21.81 U9.7 ; U8.7 26.89,15.87 26.7,16.07
  Top Layer w0.508: v1(25.58,16.54) 25.98,16.14 26.59,16.14 ; CARD1.4 22.52,25.53 v1(25.58,22.48) 25.98,22.08 26.59,22.08
  Bottom Layer w0.508: v1(25.58,16.54) v1(25.58,22.48)
SD1_1V8: length 7.4
  Top Layer w0.158: v1(28.33,17.09) 28.14,16.9 U8.4 ; v1(28.33,23.02) 28.14,22.83 U9.4
  Bottom Layer w0.508: v1(28.33,17.09) v1(28.33,23.02)
SD1_CD: length 1.6
  Top Layer w0.158: CARD2.9 TP2.1
SD1_CLK: length 28
  Top Layer w0.158: v1(42.78,24.39) 42.59,24.2 U7.4 ; v1(42.78,17.09) 42.59,16.9 42.59,16.42 ; 41.34,28.95 v1(41.34,27.96)
  SIG03 w0.142: v1(41.34,27.96) 42.06,27.96 42.16,27.86 42.16,27.03 42.26,26.93 42.49,26.93 42.59,27.03 42.59,27.86 42.69,27.96 42.91,27.96 43.01,27.86 43.01,27.03 43.12,26.93 43.34,26.93 43.44,27.03 43.44,27.86 43.54,27.96 43.77,27.96 43.87,27.86 43.87,27.03 43.97,26.93 44.19,26.93 44.3,27.03 44.3,27.86 44.4,27.96 44.71,27.96 45.01,27.66 45.01,26.74 45.61,26.14 45.61,25.04 45.47,24.9 44.7,24.9 44.6,25 44.6,25.61 44.5,25.71 44.27,25.71 44.17,25.61 44.17,25 44.07,24.9 42.98,24.9 42.78,24.7 v1(42.78,24.39)
  Bottom Layer w0.158: v1(42.78,17.09) v1(42.78,24.39)
SD1_CMD: length 28
  Top Layer w0.158: 43,16.42 43,16.6 v1(43.48,17.09) ; 39.14,28.95 v1(39.14,27.96) ; U7.3 43,23.91 v1(43.48,24.39)
  SIG03 w0.142: v1(43.48,24.39) 46.59,24.39 46.89,24.69 46.89,25.2 46.79,25.3 46.14,25.3 46.04,25.4 46.04,25.62 46.14,25.72 46.79,25.72 46.89,25.82 46.89,26.38 46.2,27.07 46.05,27.07 45.74,26.76 45.59,26.76 45.44,26.92 45.44,27.06 45.75,27.38 45.75,27.52 44.82,28.45 39.63,28.45 v1(39.14,27.96)
  Bottom Layer w0.158: v1(43.48,17.09) v1(43.48,24.39)
SD1_DAT0: length 27.9
  Top Layer w0.158: v1(36.25,17.09) 35.77,16.6 U2.3 ; v1(36.25,24.39) 35.77,23.91 U3.3 ; CARD2.7 v1(43.54,30.31)
  SIG03 w0.142: v1(36.25,24.39) 36.25,24.95 36.36,25.05 36.48,25.05 36.58,25.15 36.58,25.37 36.48,25.48 36.36,25.48 36.25,25.58 36.25,25.8 36.36,25.9 36.48,25.9 36.58,26 36.58,26.23 36.48,26.33 36.36,26.33 36.25,26.43 36.25,26.65 36.36,26.76 36.48,26.76 36.58,26.86 36.58,27.08 36.48,27.18 36.36,27.18 36.25,27.28 36.25,28.34 37.82,29.91 38.56,29.91 38.66,30.01 38.66,30.42 38.76,30.52 38.99,30.52 39.09,30.42 39.09,30.01 39.19,29.91 39.41,29.91 39.51,30.01 39.51,30.42 39.62,30.52 39.84,30.52 39.94,30.42 39.94,30.01 40.04,29.91 40.27,29.91 40.37,30.01 40.37,30.39 40.47,30.49 40.69,30.49 40.79,30.39 40.79,30.01 40.9,29.91 43.13,29.91 v1(43.54,30.31)
  Bottom Layer w0.158: v1(36.25,17.09) v1(36.25,24.39)
SD1_DAT1: length 27.9
  Top Layer w0.158: U3.4 35.37,24.2 v1(35.56,24.39) ; v1(35.56,17.09) 35.37,16.9 U2.4 ; CARD2.8 v1(44.64,30.31)
  SIG03 w0.142: v1(44.64,30.31) 43.96,30.99 42.68,30.99 42.58,30.89 42.58,30.48 42.48,30.38 42.26,30.38 42.16,30.48 42.16,30.89 42.06,30.99 41.83,30.99 41.73,30.89 41.73,30.48 41.63,30.38 41.4,30.38 41.3,30.48 41.3,30.89 41.2,30.99 38.15,30.99 35.56,28.4 v1(35.56,24.39)
  Bottom Layer w0.158: v1(35.56,17.09) v1(35.56,24.39)
SD1_DAT2: length 28
  Top Layer w0.158: v1(50.71,24.39) 50.22,23.91 U5.3 ; v1(50.71,17.09) 50.22,16.6 U4.3 ; 36.94,28.95 v1(36.94,27.96)
  SIG03 w0.142: v1(36.94,27.96) 38.46,29.48 45.7,29.48 50.71,24.47 v1(50.71,24.39)
  Bottom Layer w0.158: v1(50.71,17.09) v1(50.71,24.39)
SD1_DAT3: length 28
  Top Layer w0.158: v1(50.01,24.39) 49.82,24.2 U5.4 ; v1(50.01,17.09) 49.82,16.9 U4.4 ; 38.04,28.95 v1(38.04,27.96)
  SIG03 w0.142: v1(38.04,27.96) 38.96,28.88 45.53,28.88 45.93,28.48 45.93,28.34 45.8,28.21 45.8,28.07 45.96,27.91 46.1,27.91 46.23,28.03 46.37,28.03 46.53,27.88 46.53,27.73 46.41,27.61 46.41,27.47 46.57,27.31 46.71,27.31 46.83,27.43 46.97,27.43 47.13,27.27 47.13,27.13 47.01,27.01 47.01,26.86 47.17,26.7 47.31,26.7 47.44,26.83 47.58,26.83 47.74,26.67 47.74,26.53 47.61,26.4 47.61,26.26 47.77,26.1 47.91,26.1 48.04,26.22 48.18,26.22 48.34,26.07 48.34,25.92 48.22,25.8 48.22,25.66 48.38,25.5 48.52,25.5 48.64,25.62 48.78,25.62 v1(50.01,24.39)
  Bottom Layer w0.158: v1(50.01,17.09) v1(50.01,24.39)
SD1_VDD: length 25.9
  Top Layer w0.158: v1(29.03,17.09) 28.54,16.6 U8.3 ; U9.3 28.54,22.54 v1(29.03,23.02)
  Top Layer w0.508: 34.38,27.35 34.38,26.45 v1(34.37,26.44) ; 34.38,27.41 34.38,28.89 36.17,30.69 39.83,30.69 40.24,30.27 CARD2.4
  Bottom Layer w0.508: v1(34.37,26.44) 30.68,26.44 29.03,24.79 v1(29.03,23.02) v1(29.03,17.09)
SD2_1V8: length 7.6
  Top Layer w0.158: v1(26.94,23.02) 27.34,22.62 U9.6 ; U8.6 27.34,16.69 v1(26.94,17.09)
  Bottom Layer w0.508: v1(26.94,17.09) v1(26.94,23.02)
SD2_CD: length 1.9
  Top Layer w0.158: TP3.1 64.37,27.73 63.46,28.65 CARD3.9
SD2_CLK: length 43.6
  Top Layer w0.158: U7.6 41.79,23.99 v1(41.39,24.39) 41.39,24.3 40.46,23.37 39.06,23.37 38.81,23.62 38.81,24.54 39.23,24.96 39.39,24.96 40.04,24.3 40.2,24.3 40.38,24.48 40.38,24.64 39.72,25.29 39.72,25.45 40.15,25.88 40.85,25.88 40.96,25.77 40.96,25.26 41.08,25.15 41.33,25.15 41.44,25.26 41.44,25.77 41.55,25.88 46.64,25.88 48.42,27.66 50.89,27.66 52.1,28.87 52.1,29.51 53.71,31.12 57.15,31.12 57.26,31.01 57.26,30.64 57.37,30.52 57.62,30.52 57.73,30.64 57.73,31.01 57.84,31.12 58.27,31.12 58.47,30.92 58.47,30.6 59.06,30.01 CARD3.5 ; 41.79,16.42 41.79,16.69 v1(41.39,17.09)
  Bottom Layer w0.158: v1(41.39,24.39) v1(41.39,17.09)
SD2_CMD: length 43.6
  Top Layer w0.158: v1(42.09,17.09) 42.19,16.98 42.19,16.42 ; U7.5 42.19,24.29 v1(42.09,24.39) 42.09,25.25 42.25,25.41 44.15,25.41 44.26,25.3 44.26,23.78 44.37,23.67 44.62,23.67 44.73,23.78 44.73,25.3 44.84,25.41 45.09,25.41 45.2,25.3 45.2,23.78 45.32,23.67 45.57,23.67 45.68,23.78 45.68,25.3 45.79,25.41 46.04,25.41 46.15,25.3 46.15,23.78 46.26,23.67 46.51,23.67 46.62,23.78 46.62,25.2 48.61,27.19 49.41,27.19 49.52,27.07 49.52,26.33 49.63,26.22 49.88,26.22 49.99,26.33 49.99,27.07 50.1,27.19 50.35,27.19 50.47,27.07 50.47,26.33 50.58,26.22 50.83,26.22 50.94,26.33 50.94,27.04 51.37,27.47 51.52,27.47 51.76,27.23 51.92,27.23 52.09,27.41 52.09,27.57 51.86,27.8 51.86,27.96 52.57,28.68 52.57,29.32 53.91,30.65 56.58,30.65 56.86,30.37 CARD3.3
  Bottom Layer w0.158: v1(42.09,17.09) v1(42.09,24.39)
SD2_DAT0: length 43.6
  Top Layer w0.158: CARD3.7 61.26,29.42 60.05,30.64 59.89,30.64 59.57,30.32 59.42,30.32 59.24,30.5 59.24,30.66 59.55,30.97 59.55,31.13 59.09,31.6 53.51,31.6 51.63,29.71 51.63,29.07 50.69,28.13 48.22,28.13 46.44,26.35 39.96,26.35 38.6,25 38.45,25 38.34,24.89 38.34,24.3 38.23,24.18 37.98,24.18 37.87,24.3 37.87,24.89 37.75,25 35.46,25 v1(34.86,24.39) 34.97,24.29 34.97,22.36 ; U2.5 34.97,16.98 v1(34.86,17.09)
  Bottom Layer w0.158: v1(34.86,17.09) v1(34.86,24.39)
SD2_DAT1: length 43.7
  Top Layer w0.158: CARD3.8 62.36,29.34 59.63,32.07 53.32,32.07 51.16,29.9 51.16,29.26 50.5,28.6 48.03,28.6 46.25,26.83 39.76,26.83 38.4,25.47 35.12,25.47 34.17,24.52 v1(34.17,24.39) 34.57,23.99 34.57,22.36 ; U2.6 34.57,16.69 v1(34.17,17.09)
  Bottom Layer w0.158: v1(34.17,24.39) v1(34.17,17.09)
SD2_DAT2: length 43.6
  Top Layer w0.158: U5.5 49.42,24.29 v1(49.31,24.39) 49.31,24.72 49.69,25.1 51.1,25.1 51.29,24.9 51.29,23.52 51.59,23.22 54.01,23.22 54.17,23.06 54.17,21.85 54.53,21.49 59.84,21.49 60.1,21.75 60.1,23.98 59.84,24.23 59.38,24.23 59.26,24.12 59.26,23.36 59.15,23.24 58.9,23.24 58.79,23.36 58.79,24.12 58.68,24.23 58.43,24.23 58.32,24.12 58.32,23.33 58.21,23.22 57.96,23.22 57.85,23.33 57.85,24.12 57.74,24.23 57.49,24.23 57.38,24.12 57.38,23.33 57.26,23.22 57.01,23.22 56.9,23.33 56.9,24.12 56.79,24.23 56.54,24.23 56.43,24.12 56.43,23.33 56.32,23.22 56.07,23.22 55.96,23.33 55.96,24.12 55.85,24.23 55.33,24.23 55.07,24.5 55.07,27.59 54.66,28.01 CARD3.1 ; v1(49.31,17.09) 49.42,16.98 U4.5
  Bottom Layer w0.158: v1(49.31,17.09) v1(49.31,24.39)
SD2_DAT3: length 43.6
  Top Layer w0.158: U5.6 49.02,23.99 v1(48.62,24.39) 48.4,24.39 48.11,24.11 48.11,23.64 47.94,23.47 47.29,23.47 47.09,23.67 47.09,25 47.84,25.75 48.42,25.75 48.53,25.86 48.53,26.3 48.64,26.41 48.89,26.41 49,26.3 49,25.86 49.11,25.75 51.52,25.75 51.76,25.5 51.76,23.88 51.95,23.69 54.37,23.69 54.59,23.91 54.59,24.27 54.48,24.38 53.3,24.38 53.19,24.49 53.19,24.74 53.3,24.85 54.48,24.85 54.59,24.96 54.59,25.21 54.48,25.32 53.3,25.32 53.19,25.44 53.19,25.69 53.3,25.8 54.48,25.8 54.59,25.91 54.59,26.16 54.48,26.27 53.3,26.27 53.19,26.38 53.19,26.63 53.3,26.74 54.48,26.74 54.59,26.85 54.59,27.4 54.36,27.64 52.85,27.64 52.69,27.79 52.69,28.12 53.05,28.48 53.05,29.12 54.1,30.18 55.57,30.18 55.76,30 CARD3.2 ; U4.6 49.02,16.69 v1(48.62,17.09)
  Bottom Layer w0.158: v1(48.62,24.39) v1(48.62,17.09)
SD2_VDD: length 42
  Top Layer w0.158: U9.5 27.74,22.92 v1(27.63,23.02) ; v1(27.63,17.09) 27.74,16.98 U8.5
  Top Layer w0.508: CARD3.4 v1(57.96,27.84)
  Bottom Layer w0.508: v1(27.63,17.09) v1(27.63,23.02) 27.63,25.02 29.9,27.28 57.4,27.28 v1(57.96,27.84)
SDIN_1V8: length 24.8
  Top Layer w0.201: U8.10 27.74,14.53
  Top Layer w0.254: 27.74,14.53 27.46,14.25
  Top Layer w0.299: 13.37,6.34 U11.6 ; U11.5 12.87,6.46 12.89,6.48 ; U11.4 12.37,6.3
  Top Layer w0.508: 17.02,13.67 12.89,9.54 12.89,6.82 ; 12.89,6.82 13.37,6.34 ; 12.89,6.82 12.89,6.48 ; 12.37,6.3 12.75,6.68
  Top Layer w0.635: 27.36,14.15 26.87,13.67 17.02,13.67
SDIN_CLK: length 35.3
  Top Layer w0.158: U11.14 v1(17.37,7.7) ; 42.09,14.25 42.19,14.36 42.19,14.92
  SIG03 w0.142: v1(42.09,14.2) 41.51,13.63 35.59,13.63 33.96,12 25.41,12 25.31,12.1 25.31,12.61 25.21,12.71 24.98,12.71 24.88,12.61 24.88,12.1 24.78,12 24.55,12 24.45,12.1 24.45,12.62 24.35,12.72 24.13,12.72 24.03,12.62 24.03,12.1 23.93,12 23.7,12 23.6,12.1 23.6,12.57 23.5,12.67 23.27,12.67 23.17,12.57 23.17,12.1 23.07,12 22.85,12 22.75,12.1 22.75,12.59 22.65,12.69 22.42,12.69 22.32,12.59 22.32,12.1 22.22,12 21.67,12 v1(17.37,7.7)
SDIN_CMD: length 35.3
  Top Layer w0.158: 42.78,14.25 42.59,14.44 42.59,14.92 ; 19.37,5.25 v1(19.37,6.3)
  SIG03 w0.142: v1(19.37,6.3) 19.37,7.87 19.75,8.26 19.75,8.4 19.4,8.76 19.4,8.9 19.56,9.06 19.7,9.06 20.06,8.7 20.2,8.7 20.36,8.86 20.36,9 20,9.36 20,9.5 20.16,9.66 20.3,9.66 20.66,9.3 20.8,9.3 20.96,9.46 20.96,9.61 20.6,9.96 20.6,10.1 20.76,10.26 20.91,10.26 21.26,9.91 21.4,9.91 21.56,10.07 21.56,10.21 21.21,10.57 21.21,10.71 21.37,10.87 21.51,10.87 21.87,10.51 22.01,10.51 22.17,10.67 22.17,10.81 21.81,11.17 21.81,11.31 21.97,11.47 22.11,11.47 22.47,11.11 22.61,11.11 23.07,11.57 34.15,11.57 35.78,13.2 41.78,13.2 v1(42.78,14.2)
SDIN_DAT0: length 35.3
  Top Layer w0.158: U11.12 v1(16.37,6.3) ; 35.56,14.25 35.37,14.44 U2.11
  SIG03 w0.142: v1(35.56,14.2) 33.78,12.42 32,12.42 31.86,12.57 31.86,13.11 31.76,13.21 31.53,13.21 31.43,13.11 31.43,12.58 31.33,12.48 31.11,12.48 31.01,12.58 31.01,13.09 30.91,13.19 30.68,13.19 30.58,13.09 30.58,12.58 30.48,12.48 30.25,12.48 30.15,12.58 30.15,13.1 30.05,13.2 29.83,13.2 29.73,13.1 29.73,12.58 29.62,12.48 29.4,12.48 29.3,12.58 29.3,13.1 29.2,13.2 28.97,13.2 28.87,13.1 28.87,12.59 28.77,12.49 28.55,12.49 28.45,12.59 28.45,13.11 28.34,13.21 28.12,13.21 28.02,13.11 28.02,12.59 27.92,12.49 27.69,12.49 27.59,12.59 27.59,13.1 27.49,13.2 27.27,13.2 27.16,13.1 27.16,12.61 27.06,12.51 26.84,12.51 26.74,12.61 26.74,13.11 26.64,13.21 26.41,13.21 26.31,13.11 26.31,12.62 26.21,12.52 25.99,12.52 25.88,12.62 25.88,13.13 25.78,13.23 22.23,13.23 21.9,12.9 21.76,12.9 21.43,13.23 21.29,13.23 21.13,13.07 21.13,12.93 21.46,12.6 21.46,12.46 16.37,7.37 v1(16.37,6.3)
SDIN_DAT1: length 35.3
  Top Layer w0.158: U11.11 v1(15.87,7.7) ; U2.10 34.97,14.36 34.86,14.25
  SIG03 w0.142: v1(15.87,7.7) 15.87,8.51 16.36,9 16.5,9 16.82,8.68 16.97,8.68 17.12,8.84 17.12,8.98 16.81,9.3 16.81,9.44 16.97,9.6 17.11,9.6 17.41,9.3 17.56,9.3 17.72,9.46 17.72,9.6 17.41,9.9 17.41,10.05 17.57,10.21 17.71,10.21 18.03,9.89 18.17,9.89 18.33,10.05 18.33,10.19 18.01,10.51 18.01,10.65 18.17,10.81 18.31,10.81 18.64,10.49 18.78,10.49 18.94,10.65 18.94,10.79 18.62,11.11 18.62,11.25 18.78,11.41 18.92,11.41 19.25,11.08 19.39,11.08 19.55,11.24 19.55,11.38 19.22,11.71 19.22,11.86 19.38,12.02 19.52,12.02 19.86,11.68 20,11.68 20.16,11.84 20.16,11.98 19.82,12.32 19.82,12.46 19.98,12.62 20.13,12.62 20.43,12.32 20.57,12.32 20.73,12.48 20.73,12.62 20.43,12.92 20.43,13.06 21.02,13.66 32.27,13.66 32.37,13.56 32.37,13.04 32.47,12.94 32.69,12.94 32.8,13.04 32.8,13.56 32.9,13.66 33.12,13.66 33.22,13.56 33.22,13.01 33.32,12.91 33.55,12.91 33.65,13.01 33.65,13.56 33.75,13.66 34.32,13.66 v1(34.86,14.2)
SDIN_DAT2: length 35.3
  Top Layer w0.158: 20.37,5.25 v1(20.37,6.3) ; U4.11 49.82,14.44 50.01,14.25
  SIG03 w0.142: v1(50.01,14.2) 49.09,13.28 43.14,13.28 42.21,12.35 36.13,12.35 34.5,10.72 23.82,10.72 20.37,7.27 v1(20.37,6.3)
SDIN_DAT3: length 35.3
  Top Layer w0.158: 19.87,5.25 v1(19.87,7.7) ; U4.10 49.42,14.36 49.31,14.25
  SIG03 w0.142: v1(49.31,14.2) 48.82,13.71 42.97,13.71 42.03,12.77 35.96,12.77 34.32,11.14 23.32,11.14 v1(19.87,7.7)
SDIN_DET: length 3.7
  Top Layer w0.158: 18.87,5.25 TP4.1
SDIN_VDD: length 17.7
  Top Layer w0.201: 28.25,14.48 28.14,14.59 U8.11
  Top Layer w0.203: 28.25,14.48 28.25,14.18
  Top Layer w0.299: U11.15 17.87,6.16 18.11,6.4
  Top Layer w0.508: 18.11,6.4 18.11,9.96 20.8,12.65 27.13,12.65 28.25,13.77 28.25,14.18
SDOUT_1V8: length 48.2
  Top Layer w0.201: 27.74,19.65 U9.10
  Top Layer w0.299: U12.6 60.87,6.14 60.76,6.25 v1(60.37,6.25) ; U12.4 59.87,6.1 60.02,6.25 v1(60.37,6.25) ; U12.5 v1(60.37,6.25)
  Top Layer w0.635: 27.74,19.65 27.74,19.3 28.88,18.16 v1(29.84,18.16)
  SIG03 w0.635: v1(29.84,18.16) 30.12,17.88 56.9,17.88 60.37,14.41 v1(60.37,6.97) v1(60.37,6.25)
SDOUT_CLK: length 38.3
  Top Layer w0.158: U12.14 64.87,10.22 60.73,14.37 60.73,14.52 60.99,14.79 60.99,14.94 60.81,15.12 60.66,15.12 60.39,14.86 60.24,14.86 60.06,15.03 60.06,15.19 60.32,15.45 60.32,15.61 60.14,15.78 59.98,15.78 59.73,15.53 59.57,15.53 59.39,15.7 59.39,15.86 59.69,16.16 59.69,16.32 59.51,16.49 59.36,16.49 59.06,16.19 58.9,16.19 58.72,16.37 58.72,16.53 59.02,16.82 59.02,16.98 58.84,17.16 58.68,17.16 58.39,16.86 58.23,16.86 58.06,17.04 58.06,17.2 58.35,17.49 58.35,17.65 58.17,17.82 58.01,17.82 57.72,17.53 57.56,17.53 57.39,17.71 57.39,17.86 57.65,18.13 57.65,18.29 57.48,18.47 57.32,18.47 57.05,18.2 56.9,18.2 56.55,18.55 43.79,18.55 42.19,20.14 U7.10
SDOUT_CMD: length 38.3
  Top Layer w0.158: U7.11 42.59,20.5 44.08,19.02 57.74,19.02 61.75,15.01 61.75,14.86 61.45,14.56 61.45,14.4 61.63,14.23 61.79,14.23 62.05,14.49 62.21,14.49 62.39,14.31 62.39,14.16 62.13,13.9 62.13,13.74 62.3,13.56 62.46,13.56 62.73,13.83 62.89,13.83 63.06,13.66 63.06,13.5 62.79,13.23 62.79,13.07 62.97,12.89 63.13,12.89 63.4,13.16 63.56,13.16 63.73,12.99 63.73,12.83 63.47,12.57 63.47,12.41 63.65,12.24 63.81,12.24 64.06,12.49 64.22,12.49 64.39,12.31 64.39,12.16 64.15,11.91 64.15,11.76 64.33,11.58 64.49,11.58 64.75,11.85 64.91,11.85 66.87,9.89 U12.18
SDOUT_DAT0: length 38.3
  Top Layer w0.158: U3.11 35.37,20.41 37.71,18.07 56.35,18.07 63.87,10.56 U12.12
SDOUT_DAT1: length 38.2
  Top Layer w0.158: 34.97,20.86 34.97,20.13 37.49,17.6 56.01,17.6 63.37,10.24 U12.11
SDOUT_DAT2: length 38.4
  Top Layer w0.158: U5.11 49.82,20.44 50.3,19.96 59.75,19.96 63.5,16.21 63.5,16.05 62.97,15.52 62.97,15.37 63.15,15.19 63.31,15.19 63.83,15.72 63.99,15.72 64.17,15.54 64.17,15.38 63.66,14.88 63.66,14.72 63.84,14.54 64,14.54 64.5,15.05 64.66,15.05 64.84,14.87 64.84,14.71 64.29,14.16 64.29,14.01 64.46,13.83 64.62,13.83 65.13,14.34 65.29,14.34 65.46,14.16 65.46,14 64.96,13.5 64.96,13.34 65.14,13.17 65.29,13.17 65.79,13.66 65.94,13.66 66.12,13.48 66.12,13.33 65.66,12.86 65.66,12.7 65.83,12.53 65.99,12.53 66.46,13 66.62,13 66.79,12.82 66.79,12.66 66.29,12.16 66.29,12 66.47,11.83 66.63,11.83 67.18,12.38 67.33,12.38 67.87,11.84 U12.20
SDOUT_DAT3: length 38.3
  Top Layer w0.158: U12.19 67.37,10.06 62.16,15.26 62.16,15.42 62.75,16.01 62.75,16.17 62.58,16.34 62.42,16.34 61.83,15.76 61.67,15.76 61.5,15.93 61.5,16.09 62.09,16.68 62.09,16.84 61.91,17.02 61.75,17.02 61.16,16.42 61,16.42 60.83,16.6 60.83,16.76 61.42,17.35 61.42,17.51 61.24,17.68 61.09,17.68 60.49,17.09 60.34,17.09 60.16,17.27 60.16,17.43 60.78,18.04 60.78,18.2 60.6,18.38 60.44,18.38 59.83,17.76 59.67,17.76 59.49,17.94 59.49,18.09 60.11,18.71 60.11,18.87 59.93,19.04 59.77,19.04 59.16,18.43 59,18.43 58.82,18.6 58.82,18.76 59.22,19.16 59.22,19.31 59.04,19.49 58.88,19.49 58.49,19.1 58.33,19.1 57.94,19.49 50.1,19.49 49.42,20.17 U5.10
SDOUT_DET: length 3.7
  Top Layer w0.158: TP5.1 U12.17
SDOUT_VDD: length 49.4
  Top Layer w0.201: 28.26,20.21 28.14,20.33 U9.11
  Top Layer w0.299: U12.15 v1(65.37,6.25)
  Top Layer w0.508: v1(29.84,19.18) 29.29,19.18 28.26,20.21
  SIG03 w0.508: v1(65.37,6.25) 65.37,14.49 60.97,18.89 30.13,18.89 v1(29.84,19.18)
SEL0_IN: length 32.2
  Top Layer w0.158: v1(51.16,15.39) 51.07,15.48 50.27,15.48 ; 50.65,11.99 50.65,11.27 50.3,10.93 49.33,10.93 48.91,10.51 U1.30 ; 35.82,15.48 36.62,15.48 v1(36.7,15.39) ; v1(29.48,15.39) 29.39,15.48 28.59,15.48 ; 43.04,15.48 43.85,15.48 v1(43.93,15.39)
  SIG03 w0.158: v1(51.16,15.39) v1(43.93,15.39) v1(36.7,15.39) v1(29.48,15.39)
  Bottom Layer w0.158: v1(50.65,12.14) 51.15,12.65 51.15,15.39 v1(51.16,15.39)
SEL0_OUT: length 38
  Top Layer w0.158: v1(52.12,12.91) 51.45,12.23 51.45,11.01 50.91,10.48 U1.26 ; v1(51.23,21.33) 51.15,21.41 U5.1 ; v1(29.73,21.33) 29.65,21.41 U9.1 ; U3.1 36.7,21.41 v1(36.78,21.33) ; v1(44.01,21.33) 43.92,21.41 43.04,21.41
  SIG03 w0.158: v1(29.73,21.33) v1(36.78,21.33) v1(44.01,21.33) v1(51.23,21.33)
  Bottom Layer w0.158: v1(51.23,21.33) 52.12,20.44 v1(52.12,12.91)
SEL1_IN: length 34.9
  Top Layer w0.158: 35.82,15.87 36.17,15.87 36.35,16.06 v1(36.7,16.06) ; v1(51.16,16.06) 50.81,16.06 50.62,15.87 U4.2 ; U8.2 28.94,15.87 29.12,16.06 v1(29.48,16.06) ; U1.29 49.4,9.88 49.4,10.37 49.65,10.61 50.6,10.61 ; v1(43.93,16.06) 43.58,16.06 43.4,15.87 U6.2 ; v1(50.62,12.91) 51.13,12.4 51.13,11.14 50.6,10.61
  SIG03 w0.158: v1(29.48,16.06) 30.02,16.6 36.16,16.6 v1(36.7,16.06) 37.25,16.6 43.38,16.6 v1(43.93,16.06) 44.48,16.6 50.61,16.6 v1(51.16,16.06)
  Bottom Layer w0.158: v1(51.16,16.06) 50.98,16.06 50.62,15.7 v1(50.62,12.91)
SEL1_OUT: length 39.3
  Top Layer w0.158: v1(36.78,21.99) 36.6,21.81 U3.2 ; v1(29.73,21.99) 29.55,21.81 U9.2 ; U5.2 51.05,21.81 v1(51.23,21.99) ; 43.04,21.81 43.83,21.81 v1(44.01,21.99) ; U1.25 51.41,10.54 51.76,10.89 51.76,11.76 v1(52.15,12.14)
  SIG03 w0.158: v1(51.23,21.99) v1(44.01,21.99) v1(36.78,21.99) v1(29.73,21.99)
  Bottom Layer w0.158: v1(52.15,12.14) 52.65,12.65 52.65,20.96 51.62,21.99 v1(51.23,21.99)
SWCLK: length 29.1
  Top Layer w0.158: U1.24 53.32,9.22 v1(53.82,8.72)
  SIG03 w0.158: v1(53.82,8.72) 53.82,4.5 52.45,3.13 33.61,3.13 DEBUG.3
SWDIO: length 29.5
  Top Layer w0.158: U1.23 v1(52.83,8.72)
  SIG03 w0.158: v1(52.83,8.72) 52.83,4.35 52.12,3.64 31.57,3.64 29.59,1.65
WS2812_CTRL: length 60.5
  Top Layer w0.158: U1.10 48.41,5.07 v1(48.41,4.12) ; v1(16.94,25.53) 15.93,25.53 11.74,29.71 LED1.3
  Bottom Layer w0.158: v1(16.94,25.53) 16.94,12.2 25.02,4.12 v1(48.41,4.12)
$1N18187: length 4.4
  Top Layer w0.158: U10.1 31.32,4.8 30.1,6.02 R31.2
$1N18188: length 6.4
  Top Layer w0.158: U10.2 32.59,4.8 29.82,7.57 R32.2
$1N18189: length 8.2
  Top Layer w0.158: R33.2 29.49,9.12 33.86,4.75 U10.3
$1N18190: length 10.1
  Top Layer w0.158: 35.13,4.54 35.13,4.8 29.26,10.67 R34.2
$1N18208: length 1.9
  Top Layer w0.158: Power.2 R38.1
$1N18221: length 1.9
  Top Layer w0.28: U1.32 47.91,10.61
  Top Layer w0.508: 47.91,10.61 C16.1
$1N24796: length 5.5
  Top Layer w0.158: LED3.1 48.53,36.65 48,37.18 TP6.1
$1N24800: length 17.3
  Top Layer w0.158: 46.92,34.22 45.77,34.22 43.94,36.05 LED2.1 ; 46.92,34.22 LED3.3
$1N24806: length 17.8
  Top Layer w0.158: LED2.3 29.78,34.32 28.05,36.05 LED1.1

## Copper pours and planes (outline as drawn; the poured copper is in the pictures)
3V3 on PWR05: -5,44.5 83.41,44.5 83.41,-1.96 -5,-1.96
GND on Top Layer: -2.97,45.9 83.82,45.9 83.82,-9.14 -2.97,-9.14
GND on Top Layer: -2.97,45.9 83.82,45.9 83.82,-9.14 -2.97,-9.14
GND on Bottom Layer: -2.97,45.9 83.82,45.9 83.82,-9.14 -2.97,-9.14
GND on GND02: -2.97,45.9 83.82,45.9 83.82,-9.14 -2.97,-9.14
GND on SIG03: -2.97,45.9 83.82,45.9 83.82,-9.14 -2.97,-9.14
GND on GND04: -2.97,45.9 83.82,45.9 83.82,-9.14 -2.97,-9.14
SDIN_1V8 on Top Layer: 12.01,7.17 13.67,7.17 13.67,6.07 12.01,6.07
SDOUT_1V8 on Top Layer: 59.73,7.28 60.82,7.28 61.01,7.08 61.01,6.02 61,6.01 59.78,6.01 59.66,6.12 59.66,7.21

## Text on the board
Bottom Solder Mask Layer: Made with | AndreiAldea.com
Bottom Silkscreen Layer: B2B | 3V3 | SWD | SWCLK | GND | SCL | SDA | SCL IN | SDA IN | SCL BRD | SDA BRD | 08.05.2025
Top Solder Mask Layer: Open Source | Multiplexer | SD Card | Modular | REV 0 | SWICHAROO | SD
Top Silkscreen Layer: PORT 0 - DUT | PORT 1 - FLASH | Address | Select
